# Altium schematic sheet SQUIDCtrl_Rev1.SchDoc: Top level , Connectors
size Letter; DrawnBy: J.-F. Cliche; Engineer: J.-F. Cliche; Organization: McGill University; DocumentNumber: 1; Revision: Rev2; SheetNumber: 1; SheetTotal: 5; PageSetup: Record=PageOptions|CenterHorizontal=True|CenterVertical=True|PrintScale=0.96|XCorrection=1.00|YCorrection=1.00|PrintKind=0|BorderSize=5000000|LeftOffset=0|BottomOffset=0|Orientation=2|PaperLength=1000|PaperWidth=1000|Scale=100|PaperSource=7|PrintQuality=-4|MediaType=1|DitherType=10|PaperKind=Letter (8.5 x 11")|PrintScaleMode=1; ProjectTitle: DAN Squid Controller; ProjectName: CSA FMUX
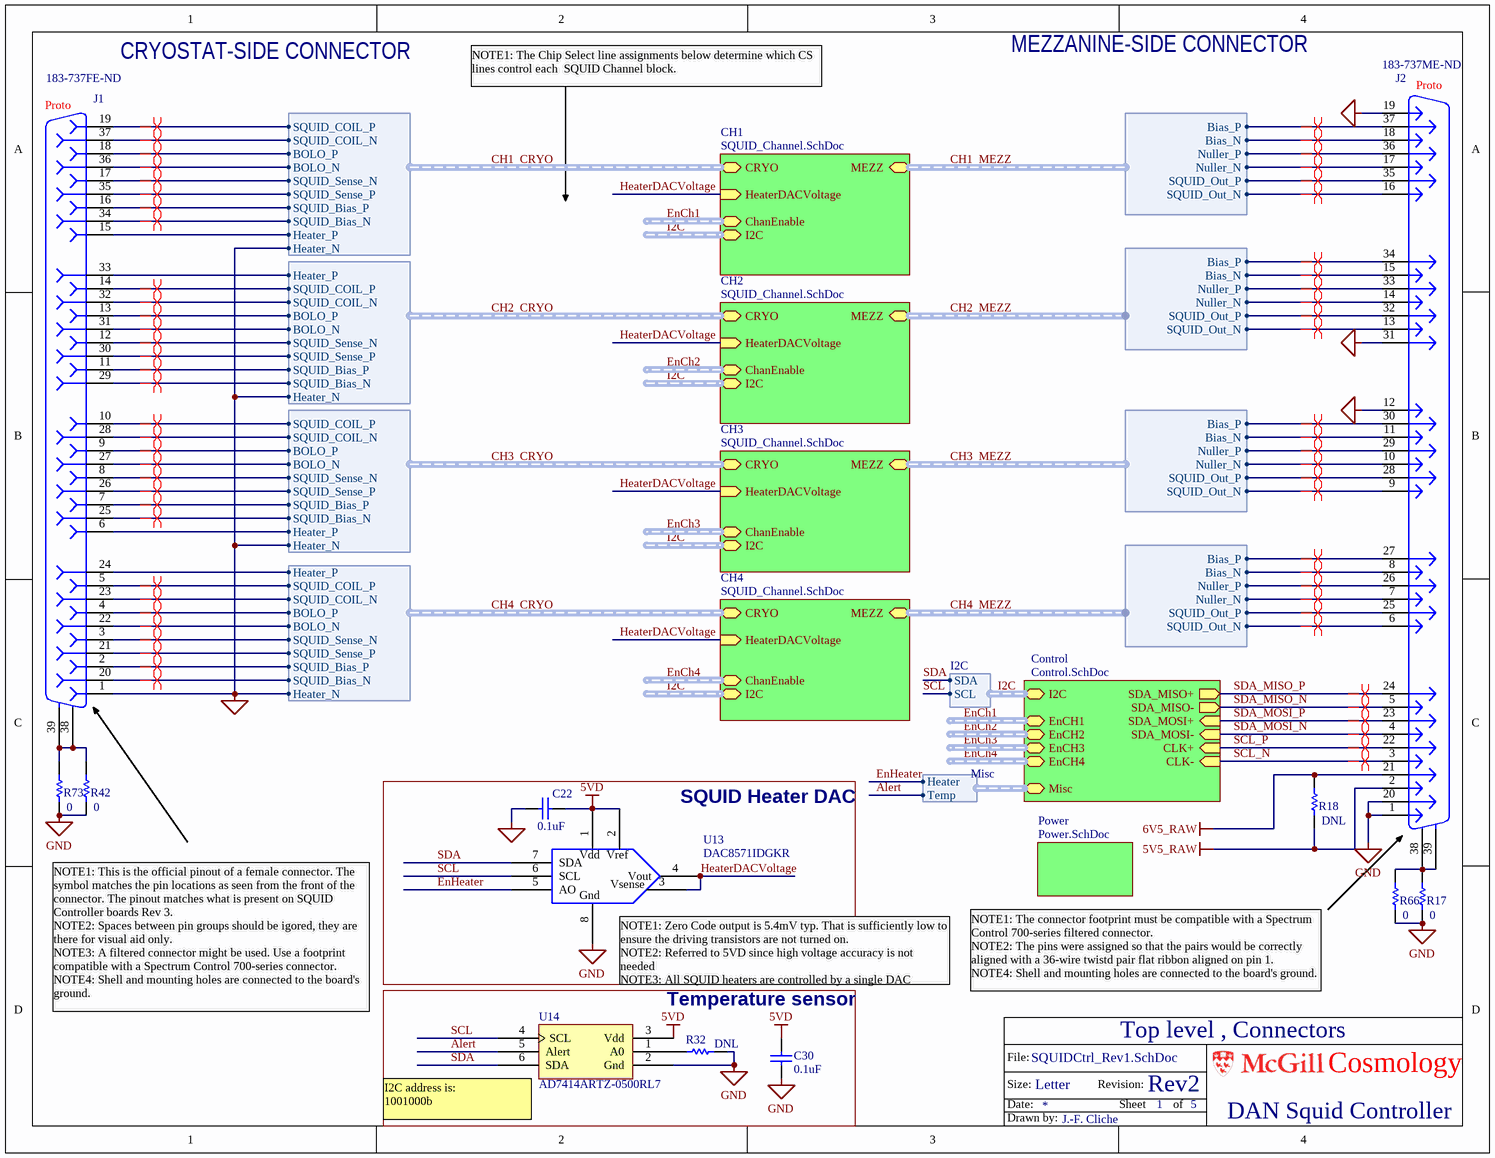
[diagram p0: SQUIDCtrl_Rev1.SchDoc]

## Parts
C22  0.1uF  [0603]
C30  0.1uF  [0603]
J1  Symbol status: Proto  Supplier Part Number 1: 183-737FE-ND  [DSUB37-F (590mils)]  (hidden comment: DB37F_Resize)
J2  Symbol status: Proto  Supplier Part Number 1: 183-737ME-ND  [DSUB37-M (590mils)]  (hidden comment: DB37M_Resize)
R17  0  [0603]
R18  DNL  [0603]
R32  DNL  [0603]
R42  0  [0603]
R66  0  [0603]
R73  0  [0603]
U13  DAC8571IDGKR  [MSOP-8]
U14  AD7414ARTZ-0500RL7  [SOT23-6]

## Blocks framed on the sheet
SQUID Heater DAC: C22 U13
Temperature sensor: C30 R32 U14

## Sub-sheets
CH1 = SQUID_Channel.SchDoc: CRYO (harness SQUID_CH_IN), MEZZ (harness SQUID_CH_OUT), HeaterDACVoltage (in), ChanEnable (harness ChannelEnables), I2C (harness I2C)
CH2 = SQUID_Channel.SchDoc: CRYO (harness SQUID_CH_IN), MEZZ (harness SQUID_CH_OUT), HeaterDACVoltage (in), ChanEnable (harness ChannelEnables), I2C (harness I2C)
CH3 = SQUID_Channel.SchDoc: CRYO (harness SQUID_CH_IN), MEZZ (harness SQUID_CH_OUT), HeaterDACVoltage (in), ChanEnable (harness ChannelEnables), I2C (harness I2C)
CH4 = SQUID_Channel.SchDoc: CRYO (harness SQUID_CH_IN), MEZZ (harness SQUID_CH_OUT), HeaterDACVoltage (in), ChanEnable (harness ChannelEnables), I2C (harness I2C)
Control = Control.SchDoc: CLK- (in), CLK+ (in), SDA_MISO+ (out), SDA_MISO- (out), SDA_MOSI+ (in), SDA_MOSI- (in), I2C (harness I2C), EnCH1 (harness ChannelEnables), EnCH2 (harness ChannelEnables), EnCH3 (harness ChannelEnables), EnCH4 (harness ChannelEnables), Misc (harness Misc)
Power = Power.SchDoc: no entries

## Harnesses
SQUID_CH_IN: SQUID_COIL_P, SQUID_COIL_N, BOLO_P, BOLO_N, SQUID_Sense_P, SQUID_Bias_P, SQUID_Bias_N, Heater_P, SQUID_Sense_N, Heater_N
SQUID_CH_OUT: Bias_P, Bias_N, Nuller_P, Nuller_N, SQUID_Out_P, SQUID_Out_N
I2C: SDA, SCL
Misc: Heater, Temp

## Nets
5V5_RAW: J2.2 R18.1
5VD: C22.2 C30.2 U13.1(Vdd) U13.2(Vref) U14.3(Vdd)
6V5_RAW: J2.21 R18.2
GND: C22.1 C30.1 J1.1 J2.1 J2.12 J2.19 J2.20 J2.31 R17.1 R32.2 R42.1 R66.1 R73.1 U13.8(Gnd) U14.2(Gnd) ; sheet CH1/CRYO.Heater_N, sheet CH2/CRYO.Heater_N, sheet CH3/CRYO.Heater_N, sheet CH4/CRYO.Heater_N  [project net CH1_CRYO.Heater_N]
Alert: U14.5(Alert) ; sheet Control/Misc.Temp
CH1_CRYO.BOLO_N: J1.36 ; sheet CH1/CRYO.BOLO_N
CH1_CRYO.BOLO_P: J1.18 ; sheet CH1/CRYO.BOLO_P
CH1_CRYO.Heater_P: J1.15 ; sheet CH1/CRYO.Heater_P
CH1_CRYO.SQUID_Bias_N: J1.34 ; sheet CH1/CRYO.SQUID_Bias_N
CH1_CRYO.SQUID_Bias_P: J1.16 ; sheet CH1/CRYO.SQUID_Bias_P
CH1_CRYO.SQUID_COIL_N: J1.37 ; sheet CH1/CRYO.SQUID_COIL_N
CH1_CRYO.SQUID_COIL_P: J1.19 ; sheet CH1/CRYO.SQUID_COIL_P
CH1_CRYO.SQUID_Sense_N: J1.17 ; sheet CH1/CRYO.SQUID_Sense_N
CH1_CRYO.SQUID_Sense_P: J1.35 ; sheet CH1/CRYO.SQUID_Sense_P
CH1_MEZZ.Bias_N: J2.18 ; sheet CH1/MEZZ.Bias_N
CH1_MEZZ.Bias_P: J2.37 ; sheet CH1/MEZZ.Bias_P
CH1_MEZZ.Nuller_N: J2.17 ; sheet CH1/MEZZ.Nuller_N
CH1_MEZZ.Nuller_P: J2.36 ; sheet CH1/MEZZ.Nuller_P
CH1_MEZZ.SQUID_Out_N: J2.16 ; sheet CH1/MEZZ.SQUID_Out_N
CH1_MEZZ.SQUID_Out_P: J2.35 ; sheet CH1/MEZZ.SQUID_Out_P
CH2_CRYO.BOLO_N: J1.31 ; sheet CH2/CRYO.BOLO_N
CH2_CRYO.BOLO_P: J1.13 ; sheet CH2/CRYO.BOLO_P
CH2_CRYO.Heater_P: J1.33 ; sheet CH2/CRYO.Heater_P
CH2_CRYO.SQUID_Bias_N: J1.29 ; sheet CH2/CRYO.SQUID_Bias_N
CH2_CRYO.SQUID_Bias_P: J1.11 ; sheet CH2/CRYO.SQUID_Bias_P
CH2_CRYO.SQUID_COIL_N: J1.32 ; sheet CH2/CRYO.SQUID_COIL_N
CH2_CRYO.SQUID_COIL_P: J1.14 ; sheet CH2/CRYO.SQUID_COIL_P
CH2_CRYO.SQUID_Sense_N: J1.12 ; sheet CH2/CRYO.SQUID_Sense_N
CH2_CRYO.SQUID_Sense_P: J1.30 ; sheet CH2/CRYO.SQUID_Sense_P
CH2_MEZZ.Bias_N: J2.15 ; sheet CH2/MEZZ.Bias_N
CH2_MEZZ.Bias_P: J2.34 ; sheet CH2/MEZZ.Bias_P
CH2_MEZZ.Nuller_N: J2.14 ; sheet CH2/MEZZ.Nuller_N
CH2_MEZZ.Nuller_P: J2.33 ; sheet CH2/MEZZ.Nuller_P
CH2_MEZZ.SQUID_Out_N: J2.13 ; sheet CH2/MEZZ.SQUID_Out_N
CH2_MEZZ.SQUID_Out_P: J2.32 ; sheet CH2/MEZZ.SQUID_Out_P
CH3_CRYO.BOLO_N: J1.27 ; sheet CH3/CRYO.BOLO_N
CH3_CRYO.BOLO_P: J1.9 ; sheet CH3/CRYO.BOLO_P
CH3_CRYO.Heater_P: J1.6 ; sheet CH3/CRYO.Heater_P
CH3_CRYO.SQUID_Bias_N: J1.25 ; sheet CH3/CRYO.SQUID_Bias_N
CH3_CRYO.SQUID_Bias_P: J1.7 ; sheet CH3/CRYO.SQUID_Bias_P
CH3_CRYO.SQUID_COIL_N: J1.28 ; sheet CH3/CRYO.SQUID_COIL_N
CH3_CRYO.SQUID_COIL_P: J1.10 ; sheet CH3/CRYO.SQUID_COIL_P
CH3_CRYO.SQUID_Sense_N: J1.8 ; sheet CH3/CRYO.SQUID_Sense_N
CH3_CRYO.SQUID_Sense_P: J1.26 ; sheet CH3/CRYO.SQUID_Sense_P
CH3_MEZZ.Bias_N: J2.11 ; sheet CH3/MEZZ.Bias_N
CH3_MEZZ.Bias_P: J2.30 ; sheet CH3/MEZZ.Bias_P
CH3_MEZZ.Nuller_N: J2.10 ; sheet CH3/MEZZ.Nuller_N
CH3_MEZZ.Nuller_P: J2.29 ; sheet CH3/MEZZ.Nuller_P
CH3_MEZZ.SQUID_Out_N: J2.9 ; sheet CH3/MEZZ.SQUID_Out_N
CH3_MEZZ.SQUID_Out_P: J2.28 ; sheet CH3/MEZZ.SQUID_Out_P
CH4_CRYO.BOLO_N: J1.22 ; sheet CH4/CRYO.BOLO_N
CH4_CRYO.BOLO_P: J1.4 ; sheet CH4/CRYO.BOLO_P
CH4_CRYO.Heater_P: J1.24 ; sheet CH4/CRYO.Heater_P
CH4_CRYO.SQUID_Bias_N: J1.20 ; sheet CH4/CRYO.SQUID_Bias_N
CH4_CRYO.SQUID_Bias_P: J1.2 ; sheet CH4/CRYO.SQUID_Bias_P
CH4_CRYO.SQUID_COIL_N: J1.23 ; sheet CH4/CRYO.SQUID_COIL_N
CH4_CRYO.SQUID_COIL_P: J1.5 ; sheet CH4/CRYO.SQUID_COIL_P
CH4_CRYO.SQUID_Sense_N: J1.3 ; sheet CH4/CRYO.SQUID_Sense_N
CH4_CRYO.SQUID_Sense_P: J1.21 ; sheet CH4/CRYO.SQUID_Sense_P
CH4_MEZZ.Bias_N: J2.8 ; sheet CH4/MEZZ.Bias_N
CH4_MEZZ.Bias_P: J2.27 ; sheet CH4/MEZZ.Bias_P
CH4_MEZZ.Nuller_N: J2.7 ; sheet CH4/MEZZ.Nuller_N
CH4_MEZZ.Nuller_P: J2.26 ; sheet CH4/MEZZ.Nuller_P
CH4_MEZZ.SQUID_Out_N: J2.6 ; sheet CH4/MEZZ.SQUID_Out_N
CH4_MEZZ.SQUID_Out_P: J2.25 ; sheet CH4/MEZZ.SQUID_Out_P
EnHeater: U13.5(AO) ; sheet Control/Misc.Heater
HeaterDACVoltage: U13.3(Vsense) U13.4(Vout) ; sheet CH1/HeaterDACVoltage, sheet CH2/HeaterDACVoltage, sheet CH3/HeaterDACVoltage, sheet CH4/HeaterDACVoltage
SCL: U13.6(SCL) U14.4(SCL) ; sheet CH1/I2C.SCL  [project net I2C.SCL]
SCL_N: J2.3 ; sheet Control/CLK-
SCL_P: J2.22 ; sheet Control/CLK+
SDA: U13.7(SDA) U14.6(SDA) ; sheet CH1/I2C.SDA  [project net I2C.SDA]
SDA_MISO_N: J2.5 ; sheet Control/SDA_MISO-
SDA_MISO_P: J2.24 ; sheet Control/SDA_MISO+
SDA_MOSI_N: J2.4 ; sheet Control/SDA_MOSI-
SDA_MOSI_P: J2.23 ; sheet Control/SDA_MOSI+
NetJ1_38: J1.38(MH1) J1.39(MH2) R42.2 R73.2
NetJ2_38: J2.38(MH1) J2.39(MH2) R17.2 R66.2
NetR32_1: R32.1 U14.1(A0)

## Buses and harness runs
harness CH1_CRYO = sheet CH1/CRYO
harness CH1_MEZZ = sheet CH1/MEZZ
harness CH2_CRYO = sheet CH2/CRYO
harness CH2_MEZZ = sheet CH2/MEZZ
harness CH3_CRYO = sheet CH3/CRYO
harness CH3_MEZZ = sheet CH3/MEZZ
harness CH4_CRYO = sheet CH4/CRYO
harness CH4_MEZZ = sheet CH4/MEZZ
harness EnCh1 = sheet CH1/ChanEnable
harness EnCh1 = sheet Control/EnCH1
harness EnCh2 = sheet CH2/ChanEnable
harness EnCh2 = sheet Control/EnCH2
harness EnCh3 = sheet CH3/ChanEnable
harness EnCh3 = sheet Control/EnCH3
harness EnCh4 = sheet CH4/ChanEnable
harness EnCh4 = sheet Control/EnCH4
harness I2C = sheet CH1/I2C
harness I2C = sheet CH2/I2C
harness I2C = sheet CH3/I2C
harness I2C = sheet CH4/I2C
harness I2C = sheet Control/I2C

## Layout directives
differential pair: CH1_CRYO.BOLO_N, CH1_CRYO.BOLO_P, CH1_CRYO.SQUID_Bias_N, CH1_CRYO.SQUID_Bias_P, CH1_CRYO.SQUID_COIL_N, CH1_CRYO.SQUID_COIL_P, CH1_CRYO.SQUID_Sense_N, CH1_CRYO.SQUID_Sense_P, CH1_MEZZ.Bias_N, CH1_MEZZ.Bias_P, CH1_MEZZ.Nuller_N, CH1_MEZZ.Nuller_P, CH1_MEZZ.SQUID_Out_N, CH1_MEZZ.SQUID_Out_P, CH2_CRYO.BOLO_N, CH2_CRYO.BOLO_P, CH2_CRYO.SQUID_Bias_N, CH2_CRYO.SQUID_Bias_P, CH2_CRYO.SQUID_COIL_N, CH2_CRYO.SQUID_COIL_P, CH2_CRYO.SQUID_Sense_N, CH2_CRYO.SQUID_Sense_P, CH2_MEZZ.Bias_N, CH2_MEZZ.Bias_P, CH2_MEZZ.Nuller_N, CH2_MEZZ.Nuller_P, CH2_MEZZ.SQUID_Out_N, CH2_MEZZ.SQUID_Out_P, CH3_CRYO.BOLO_N, CH3_CRYO.BOLO_P, CH3_CRYO.SQUID_Bias_N, CH3_CRYO.SQUID_Bias_P, CH3_CRYO.SQUID_COIL_N, CH3_CRYO.SQUID_COIL_P, CH3_CRYO.SQUID_Sense_N, CH3_CRYO.SQUID_Sense_P, CH3_MEZZ.Bias_N, CH3_MEZZ.Bias_P, CH3_MEZZ.Nuller_N, CH3_MEZZ.Nuller_P, CH3_MEZZ.SQUID_Out_N, CH3_MEZZ.SQUID_Out_P, CH4_CRYO.BOLO_N, CH4_CRYO.BOLO_P, CH4_CRYO.SQUID_Bias_N, CH4_CRYO.SQUID_Bias_P, CH4_CRYO.SQUID_COIL_N, CH4_CRYO.SQUID_COIL_P, CH4_CRYO.SQUID_Sense_N, CH4_CRYO.SQUID_Sense_P, CH4_MEZZ.Bias_N, CH4_MEZZ.Bias_P, CH4_MEZZ.Nuller_N, CH4_MEZZ.Nuller_P, CH4_MEZZ.SQUID_Out_N, CH4_MEZZ.SQUID_Out_P, SCL_N, SCL_P, SDA_MISO_N, SDA_MISO_P, SDA_MOSI_N, SDA_MOSI_P

## Notes on the sheet
- CRYOSTAT-SIDE CONNECTOR
- NOTE1: The Chip Select line assignments below determine which CS lines control each  SQUID Channel block.
- MEZZANINE-SIDE CONNECTOR
- NOTE1: This is the official pinout of a female connector. The symbol matches the pin locations as seen from the front of the connector. The pinout matches what is present on SQUID Controller boards Rev 3.
  NOTE2: Spaces between pin groups should be igored, they are there for visual aid only.
  NOTE3: A filtered connector might be used. Use a footprint compatible with a Spectrum Control 700-series connector.
  NOTE4: Shell and mounting holes are connected to the board's ground.
- (near U13) NOTE1: Zero Code output is 5.4mV typ. That is sufficiently low to ensure the driving transistors are not turned on.
  NOTE2: Referred to 5VD since high voltage accuracy is not needed
  NOTE3: All SQUID heaters are controlled by a single DAC
- NOTE1: The connector footprint must be compatible with a Spectrum Control 700-series filtered connector.
  NOTE2: The pins were assigned so that the pairs would be correctly aligned with a 36-wire twistd pair flat ribbon aligned on pin 1.
  NOTE4: Shell and mounting holes are connected to the board's ground.
- (near U14) I2C address is:
  1001000b
- File:
- Size:
- Date:
- Letter
- Revision:
- Sheet
- of
- Cosmology
- Drawn by:

## Library data of the parts
C22 C30 = Cap0603: Capacitor, Ceramic, 0603; Part Constraints: 0.1uF 16V 10% X7R; Manufacturer: Generic; Supplier 1: Digi-Key; Supplier Part Number 1: 399-1096-1-ND; Value: 0.1uF
J1 = DB37F_Resize: DB37F; Manufacturer: Generic; Part Constraints: CONN DB37 FEMALE .590" R/A; Supplier 1: Digi-Key
J2 = DB37M_Resize: DB37M; Manufacturer: Generic; Part Constraints: CONN DB37 MALE .590" R/A; Supplier 1: Digi-Key
R17 R42 R66 R73 = RES 0603: Manufacturer: Generic; Manufacturer Part Number 1: e.g CRCW0603 series; Part constraints: 0 1/10W 1% 100ppm/C 0603; Value: 0; Supplier 1: Digi-Key; Supplier Part Number 1: 541-0.0GCT-ND
R18 = RES 0603: Manufacturer: Generic; Manufacturer Part Number 1: e.g CRCW0603 series; Value: DNL; Part constraints: DNL
R32 = Res0603: RES 0603; Manufacturer: Generic; Manufacturer Part Number 1: e.g CRCW0603 series; Value: DNL; Part constraints: DNL
U13 = DAC8571IDGKR: IC DAC 16BIT I2C V-OUT LP 8-MSOP; Manufacturer 1: Texas Instruments; Category 1: Integrated Circuits (ICs); Settling Time: 12µs; Number of Bits: 16; Data Interface: I²C, Serial; Number of Converters: 1; Voltage Supply Source: Single Supply; Number of Outputs and Type: 1 Voltage, Unipolar; Sampling Rate (Per Second): 43k; Supplier 1: Digi-Key; Manufacturer Part Number 1: DAC8571IDGKR; RoHS 1: RoHS Compliant; Description 1: IC DAC 16BIT I2C V-OUT LP 8-MSOP; Stock 1: 21077; Pricing 1: 1=7.6, 10=6.839, 25=6.2192, 100=3.9792, 250=3.9054, 500=3.83172, 750=3.75803 (CAD); Power Dissipation (Max): -; Operating Temperature: -40°C ~ 105°C; Mounting Type: Surface Mount; Package / Case: 8-TSSOP, 8-MSOP (0.118", 3.00mm Width); Supplier Device Package: 8-MSOP; Packaging: Cut Tape (CT); ComponentLink1URL: http://www.ti.com/lit/ds/symlink/dac8571.pdf; ComponentLink1Description: http://www.ti.com/lit/ds/symlink/dac8571.pdf; Supplier Part Number 1: 296-14307-1-ND
U14 = AD7414ARTZ-0500RL7: Digital Temperature Sensor, 11-Bit, +/-2 Degree Accurate; Manufacturer: Analog Devices; Manufacturer 1: Analog Devices Inc; CanPurchaseFrom: Digikey; Description 1: IC SENSOR TEMP 10BIT SOT23-6; Category 1: Integrated Circuits (ICs); Function: Temp Monitoring System (Sensor); Sensor Type: Internal; Sensing Temperature: -40°C ~ 125°C; Accuracy: ±2°C; Topology: ADC, Comparator, Register Bank; Output Type: 2-Wire Serial, I²C™/SMBUS™; Output Alarm: Yes; Output Fan: No; Voltage - Supply: 2.7 V ~ 5.5 V; Footprint: *; TechInfo: *; Manufacturers P/N: AD7414ARTZ-0500RL7; Supplier 1: Digi-Key; Supplier Part Number 1: AD7414ARTZ0500RCT-ND; Manufacturer Part Number 1: AD7414ARTZ-0500RL7; RoHS 1: RoHS Compliant; Stock 1: 1906; Pricing 1: 1=3, 10=2.681, 25=2.4108, 100=2.1926, 250=1.98472 (CAD); Operating Temperature: -40°C ~ 125°C; Mounting Type: Surface Mount; Package / Case: SOT-23-6; Supplier Device Package: SOT-23-6; Packaging: Cut Tape (CT); ComponentLink1URL: http://www.analog.com/static/imported-files/data_sheets/AD7414_7415.pdf; ComponentLink1Description: http://www.analog.com/static/imported-files/data_sheets/AD7414_7415.pdf